# Altium schematic sheet Sheet1.SchDoc: Robotics Air Compressor PCB
size A; DrawnBy: Dale Frolik; Engineer: Andrew Panning, Dale Frolik; Revision: 1
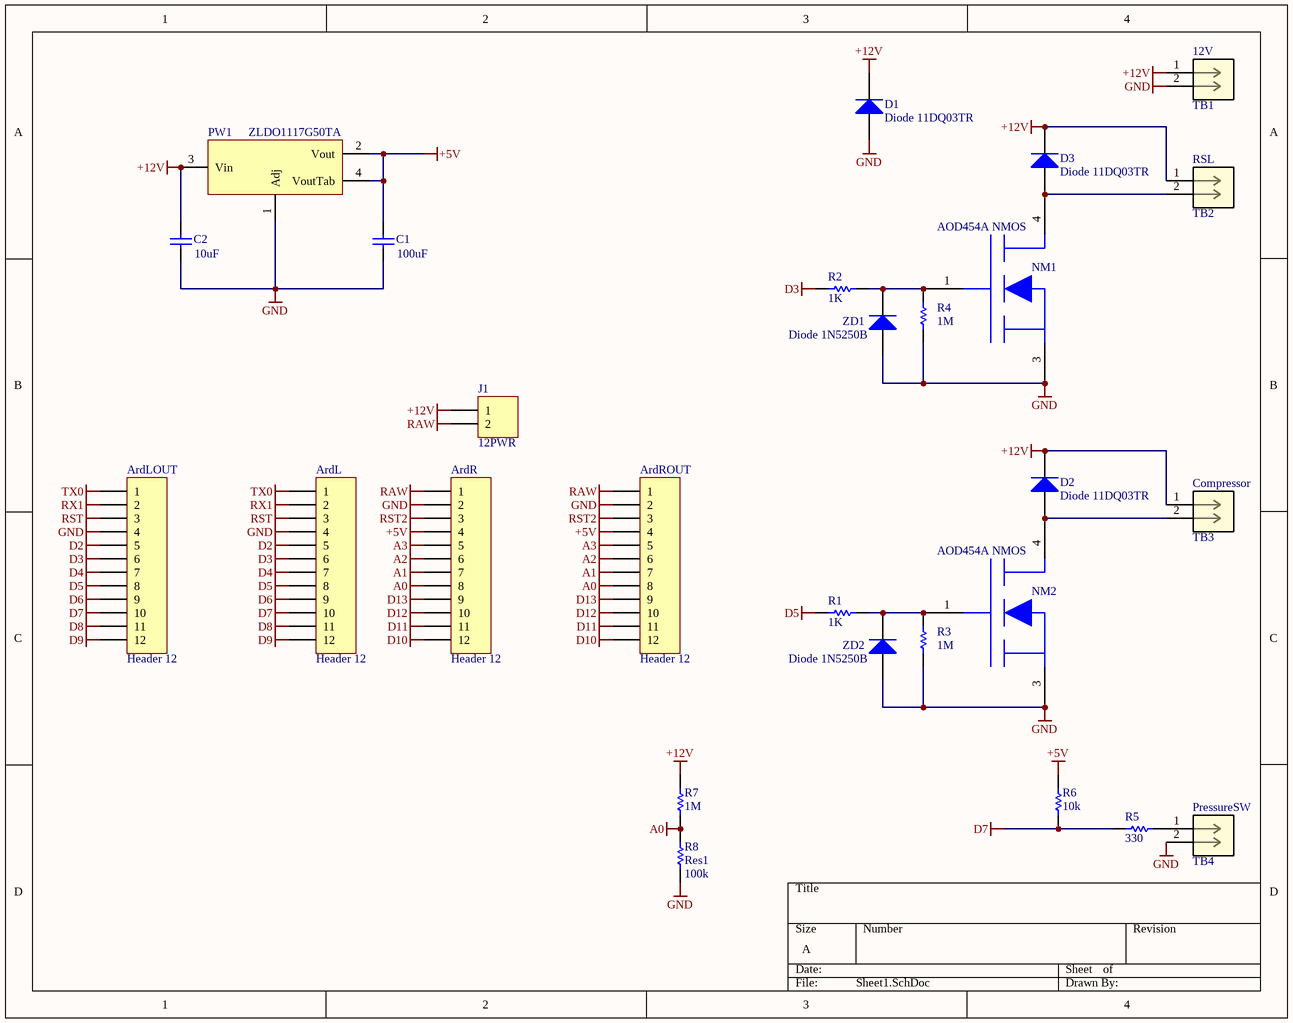
[diagram p0: Sheet1.SchDoc]

## Parts
12V  TB1  [CONN_1935161_PXC]
ArdL  Header 12  [HDR1X12]
ArdLOUT  Header 12  [HDR1X12]
ArdR  Header 12  [HDR1X12]
ArdROUT  Header 12  [HDR1X12]
C1  value 100uF  [CAPC3216L]  (hidden comment: Cap Semi)
C2  value 10uF  [CAPC3216L]  (hidden comment: Cap Semi)
Compressor  TB3  [CONN_1935161_PXC]
D1  Diode 11DQ03TR  [DIO10.46-5.3x2.8]
D2  Diode 11DQ03TR  [DIO10.46-5.3x2.8]
D3  Diode 11DQ03TR  [DIO10.46-5.3x2.8]
J1  12PWR  [HDR1X2]
NM1  AOD454A NMOS  [TO252- no center pin]
NM2  AOD454A NMOS  [TO252- no center pin]
PressureSW  TB4  [CONN_1935161_PXC]
PW1  ZLDO1117G50TA  [SOT223]
R1  value 1K  [RESC3216L]  (hidden comment: Res Semi)
R2  value 1K  [RESC3216L]  (hidden comment: Res Semi)
R3  value 1M  [RESC3216L]  (hidden comment: Res Semi)
R4  value 1M  [RESC3216L]  (hidden comment: Res Semi)
R5  value 330  [RESC3216L]  (hidden comment: Res Semi)
R6  value 10k  [RESC3216L]  (hidden comment: Res Semi)
R7  1M  [AXIAL-0.3]
R8  Res1  value 100k  [AXIAL-0.3]
RSL  TB2  [CONN_1935161_PXC]
ZD1  Diode 1N5250B  [DIO7.1-3.9x1.9]
ZD2  Diode 1N5250B  [DIO7.1-3.9x1.9]

## Nets
+5V: ArdR.4 ArdROUT.4 C1.2 PW1.2(Vout) PW1.4(VoutTab) R6.1
+12V: 12V.1 C2.2 Compressor.1 D1.2(K) D2.2(K) D3.2(K) J1.1 PW1.3(Vin) R7.2 RSL.1
A0: ArdR.8 ArdROUT.8 R7.1 R8.2
A1: ArdR.7 ArdROUT.7
A2: ArdR.6 ArdROUT.6
A3: ArdR.5 ArdROUT.5
D2: ArdL.5 ArdLOUT.5
D3: ArdL.6 ArdLOUT.6 R2.2
D4: ArdL.7 ArdLOUT.7
D5: ArdL.8 ArdLOUT.8 R1.2
D6: ArdL.9 ArdLOUT.9
D7: ArdL.10 ArdLOUT.10 R5.2 R6.2
D8: ArdL.11 ArdLOUT.11
D9: ArdL.12 ArdLOUT.12
D10: ArdR.12 ArdROUT.12
D11: ArdR.11 ArdROUT.11
D12: ArdR.10 ArdROUT.10
D13: ArdR.9 ArdROUT.9
GND: 12V.2 ArdL.4 ArdLOUT.4 ArdR.2 ArdROUT.2 C1.1 C2.1 D1.1(A) NM1.3(3_-_Source) NM2.3(3_-_Source) PressureSW.2 PW1.1(Adj) R3.1 R4.1 R8.1 ZD1.1(A) ZD2.1(A)
RAW: ArdR.1 ArdROUT.1 J1.2
RST: ArdL.3 ArdLOUT.3
RST2: ArdR.3 ArdROUT.3
RX1: ArdL.2 ArdLOUT.2
TX0: ArdL.1 ArdLOUT.1
NetCompressor_2: Compressor.2 D2.1(A) NM2.4(4_-_Drain)
NetD3_1: D3.1(A) NM1.4(4_-_Drain) RSL.2
NetNM1_1: NM1.1(1_-_Gate) R2.1 R4.2 ZD1.2(K)
NetNM2_1: NM2.1(1_-_Gate) R1.1 R3.2 ZD2.2(K)
NetPressureSW_1: PressureSW.1 R5.1

## Library data of the parts
12V Compressor PressureSW RSL = 1935161: No Description Available; Mfr_Name: Phoenix Contact; RefDes: RefDes; Type: Type
ArdL ArdLOUT ArdR ArdROUT = Header 12: Header, 12-Pin; LatestRevisionDate: 17-Jul-2002; LatestRevisionNote: Re-released for DXP Platform.; Publisher: Altium Limited
C1 C2 = Cap Semi: Capacitor (Semiconductor SIM Model); Published: 8-Jun-2000; LatestRevisionDate: 29-May-2009; LatestRevisionNote: IPC-7351 Footprint Added.; PackageReference: C1206; Publisher: Altium Limited; PackageDescription: Chip Capacitor
D1-D3 = Diode 1N4934: 1 Amp Fast Recovery Rectifier; Published: 8-Jun-2000; LatestRevisionDate: 17-Jul-2002; LatestRevisionNote: Re-released for DXP Platform.; DatasheetVersion: 1999; PackageVersion: Aug-1999; PackageReference: DO-41; Publisher: Altium Limited; Code_JEDEC: DO-204-AL; ComponentLink1Description: Manufacturer Link; ComponentLink1URL: http://www.fairchildsemi.com/; ComponentLink2Description: Datasheet; ComponentLink2URL: http://www.fairchildsemi.com/ds/1N%2F1N4934.pdf
J1 = Header 2: Header, 2-Pin; LatestRevisionDate: 17-Jul-2002; LatestRevisionNote: Re-released for DXP Platform.; Publisher: Altium Limited
R1-R6 = Res Semi: Semiconductor Resistor; Published: 8-Jun-2000; LatestRevisionDate: 17-Jul-2002; LatestRevisionNote: Re-released for DXP Platform.; PackageReference: AXIAL-0.5; Publisher: Altium Limited
R7 R8 = Res1: Resistor; Published: 8-Jun-2000; LatestRevisionDate: 17-Jul-2002; LatestRevisionNote: Re-released for DXP Platform.; PackageReference: AXIAL-0.3; Publisher: Altium Limited
ZD1 ZD2 = Diode 1N4448: High Conductance Fast Diode; Published: 8-Jun-2000; LatestRevisionDate: 17-Jul-2002; LatestRevisionNote: Re-released for DXP Platform.; DatasheetVersion: 1997; PackageReference: DO-35; Publisher: Altium Limited; Code_JEDEC: DO-204-AH; ComponentLink1Description: Manufacturer Link; ComponentLink1URL: http://www.fairchildsemi.com/; ComponentLink2Description: Datasheet; ComponentLink2URL: http://www.fairchildsemi.com/ds/1N%2F1N4448.pdf